# Altium schematic sheet ASBB_3VLDO.SchDoc
size A4
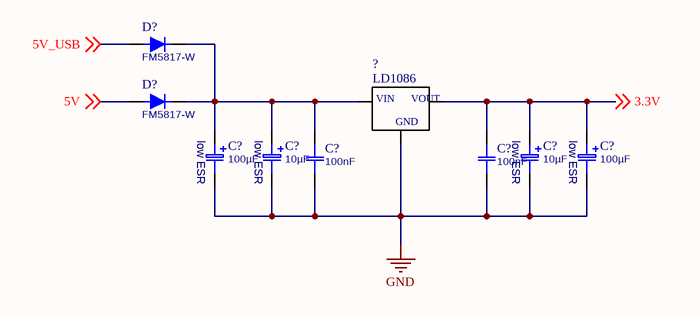
[diagram p0: ASBB_3VLDO.SchDoc]

## Parts
(Parts that share a designator on the sheet are numbered #1, #2 ... from top to bottom, then left to right.)
?  LD1086  [D2PAK_LD1086(Primary)]
C?#1  100µF  [SMELK-C]
C?#2  10µF  [SMELK-C]
C?#3  10µF  [SMELK-C]
C?#4  100µF  [SMELK-C]
C?#5  100nF  [0603]
C?#6  100nF  [0603]
D?#1  FM5817-W  [SMB]
D?#2  FM5817-W  [SMB]

## Nets
GND: ?.GND C?#1.2(-) C?#2.2(-) C?#3.2(-) C?#4.2(-) C?#5.1 C?#6.1
3.3V: ?.VOUT C?#3.1(+) C?#4.1(+) C?#6.2 ; off-sheet 3.3V
5V: D?#2.2(A) ; off-sheet 5V
5V_USB: D?#1.2(A) ; off-sheet 5V_USB
Net?_VIN: ?.VIN C?#1.1(+) C?#2.1(+) C?#5.2 D?#1.1(C) D?#2.1(C)

## Notes on the sheet
- (in symbol Capacitor polarised low ESR) low ESR

## Library data of the parts
? = LD1086: Semiconductors and Actives; MF: STMicroelectronics; MP: LD1086; Availability: Unavailable; SnapEDA_Link: https://www.snapeda.com/parts/LD1086/STMicroelectronics/view-part/?ref=snap; Package: None; Price: None; Value: *
C?#1-C?#4 = Capacitor polarised low ESR: Capacitor, polarised, low ESR; Partnumber: ?; Value: ?
C?#5 C?#6 = Capacitor: Partnumber: ?; Value: ?
D?#1 D?#2 = Diode: Partnumber: ?; Value: ?